# EAGLE design schaltplan (EAGLE 7.2.0)
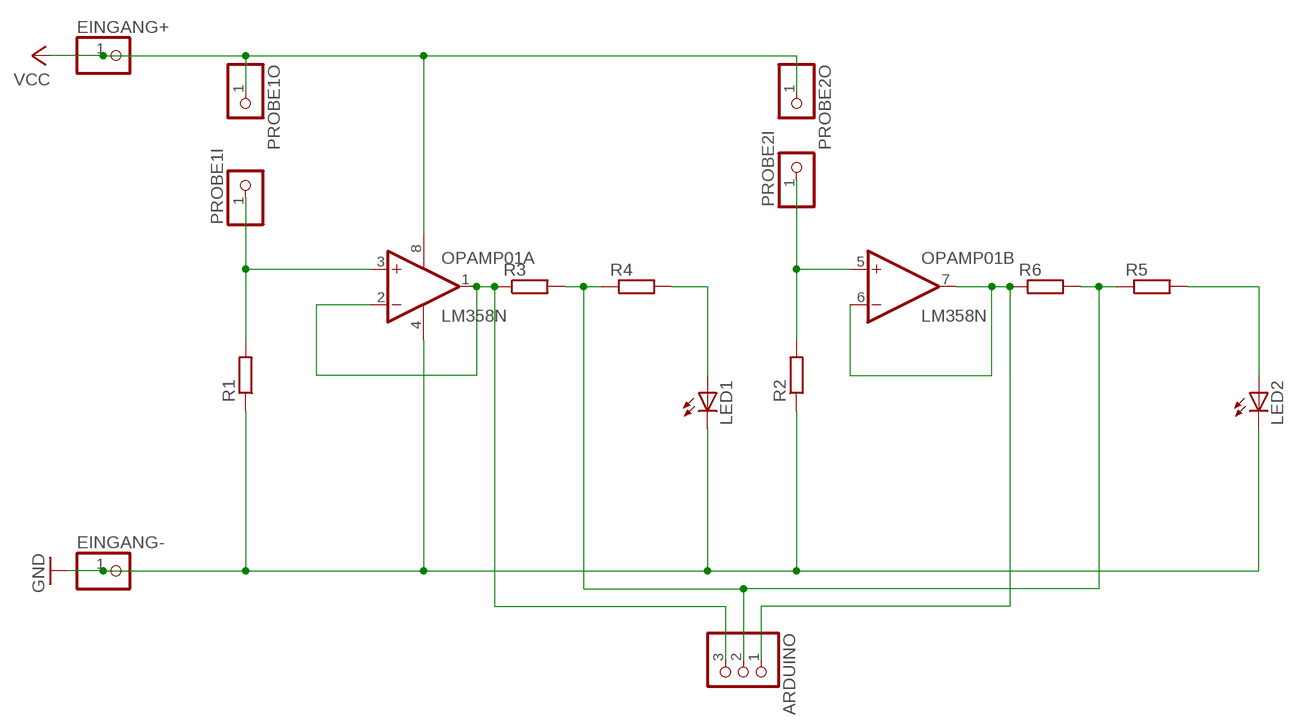
[diagram p0: schematic, sheet 1]

## Parts
ARDUINO  PINHD-1X3  [1X03]
EINGANG+  PINHD-1X1  [1X01]
EINGANG-  PINHD-1X1  [1X01]
LED1  LED5MM  [LED5MM]
LED2  LED5MM  [LED5MM]
OPAMP01  LM358N  [DIL08]
PROBE1I  PINHD-1X1  [1X01]
PROBE1O  PINHD-1X1  [1X01]
PROBE2I  PINHD-1X1  [1X01]
PROBE2O  PINHD-1X1  [1X01]
R1  R-EU_0207/7  [0207/7]
R2  R-EU_0207/7  [0207/7]
R3  R-EU_0207/7  [0207/7]
R4  R-EU_0207/7  [0207/7]
R5  R-EU_0207/7  [0207/7]
R6  R-EU_0207/7  [0207/7]

## Nets
GND: EINGANG-.1 LED1.K(C) LED2.K(C) OPAMP01.4(P:V-) R1.1 R2.1
N$1: OPAMP01.3(A:+IN) PROBE1I.1 R1.2
N$2: OPAMP01.5(B:+IN) PROBE2I.1 R2.2
N$3: ARDUINO.3 OPAMP01.1(A:OUT) OPAMP01.2(A:-IN) R3.1
N$4: LED1.A R4.2
N$6: ARDUINO.1 OPAMP01.6(B:-IN) OPAMP01.7(B:OUT) R6.1
N$7: ARDUINO.2 R3.2 R4.1 R5.1 R6.2
N$8: LED2.A R5.2
VCC: EINGANG+.1 OPAMP01.8(P:V+) PROBE1O.1 PROBE2O.1

## Library data of the parts
ARDUINO = pinhead:PINHD-1X3: PIN HEADER
EINGANG+ EINGANG- PROBE1I PROBE1O PROBE2I PROBE2O = pinhead:PINHD-1X1: PIN HEADER
LED1 LED2 = led:LED: LED OSRAM: - CHIPLED LG R971, LG N971, LY N971, LG Q971, LY Q971, LO R971, LY R971 LH N974, LH R974 LS Q976, LO Q976, LY Q976 LO Q996 - Hyper CHIPLED LW Q18S LB Q993, LB Q99A, LB R99A - SideLED LS A670, LO A670, LY A670, LG A670, LP A670 LB A673, LV A673, LT A673, LW A673 LH A674 LY A675 LS A676, LA A676, LO A676, LY A676, LW A676 LS A679, LY A679, LG A679 - Hyper Micro SIDELED® LS Y876, LA Y876, LO Y876, LY Y876 LT Y87S - SmartLED LW L88C, LW L88S LB L89C, LB L89S, LG L890 LS L89K, LO L89K, LY L89K LS L896, LA L896, LO L896, LY L896 - TOPLED LS T670, LO T670, LY T670, LG T670, LP T670 LSG T670, LSP T670, LSY T670, LOP T670, LYG T670 LG T671, LOG T671, LSG T671 LB T673, LV T673, LT T673, LW T673 LH T674 LS T676, LA T676, LO T676, LY T676, LB T676, LH T676, LSB T676, LW T676 LB T67C, LV T67C, LT T67C, LS T67K, LO T67K, LY T67K, LW E67C LS E67B, LA E67B, LO E67B, LY E67B, LB E67C, LV E67C, LT E67C LW T67C LS T679, LY T679, LG T679 LS T770, LO T770, LY T770, LG T770, LP T770 LB T773, LV T773, LT T773, LW T773 LH T774 LS E675, LA E675, LY E675, LS T675 LS T776, LA T776, LO T776, LY T776, LB T776 LHGB T686 LT T68C, LB T68C - Hyper Mini TOPLED® LB M676 - Mini TOPLED Santana® LG M470 LS M47K, LO M47K, LY M47K Source: http://www.osram.convergy.de LUXEON: - LUMILED® LXK2-PW12-R00, LXK2-PW12-S00, LXK2-PW14-U00, LXK2-PW14-V00 LXK2-PM12-R00, LXK2-PM12-S00, LXK2-PM14-U00 LXK2-PE12-Q00, LXK2-PE12-R00, LXK2-PE12-S00, LXK2-PE14-T00, LXK2-PE14-U00 LXK2-PB12-K00, LXK2-PB12-L00, LXK2-PB12-M00, LXK2-PB14-N00, LXK2-PB14-P00, LXK2-PB14-Q00 LXK2-PR12-L00, LXK2-PR12-M00, LXK2-PR14-Q00, LXK2-PR14-R00 LXK2-PD12-Q00, LXK2-PD12-R00, LXK2-PD12-S00 LXK2-PH12-R00, LXK2-PH12-S00 LXK2-PL12-P00, LXK2-PL12-Q00, LXK2-PL12-R00 Source: www.luxeon.com KINGBRIGHT: KA-3528ASYC Source: www.kingbright.com
OPAMP01 = linear:LM358: OP AMP also LM158; LM258; LM2904 Source: http://cache.national.com/ds/LM/LM158.pdf
R1-R6 = rcl:R-EU_: RESISTOR, European symbol

## Board
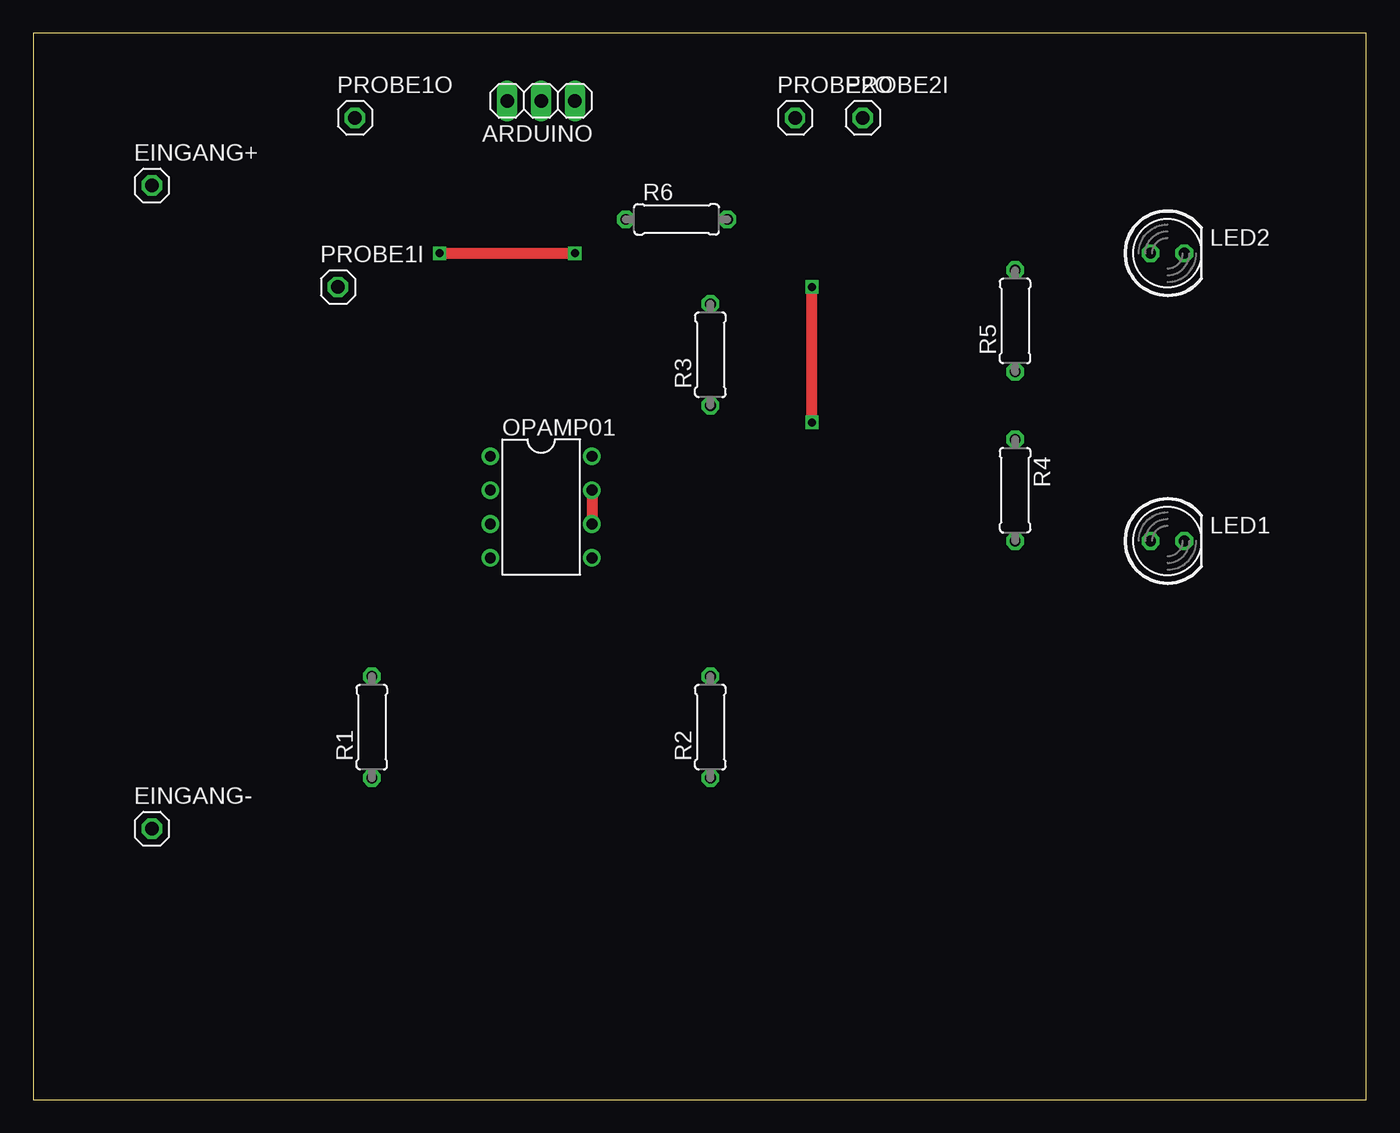
[diagram p1: board, top side]
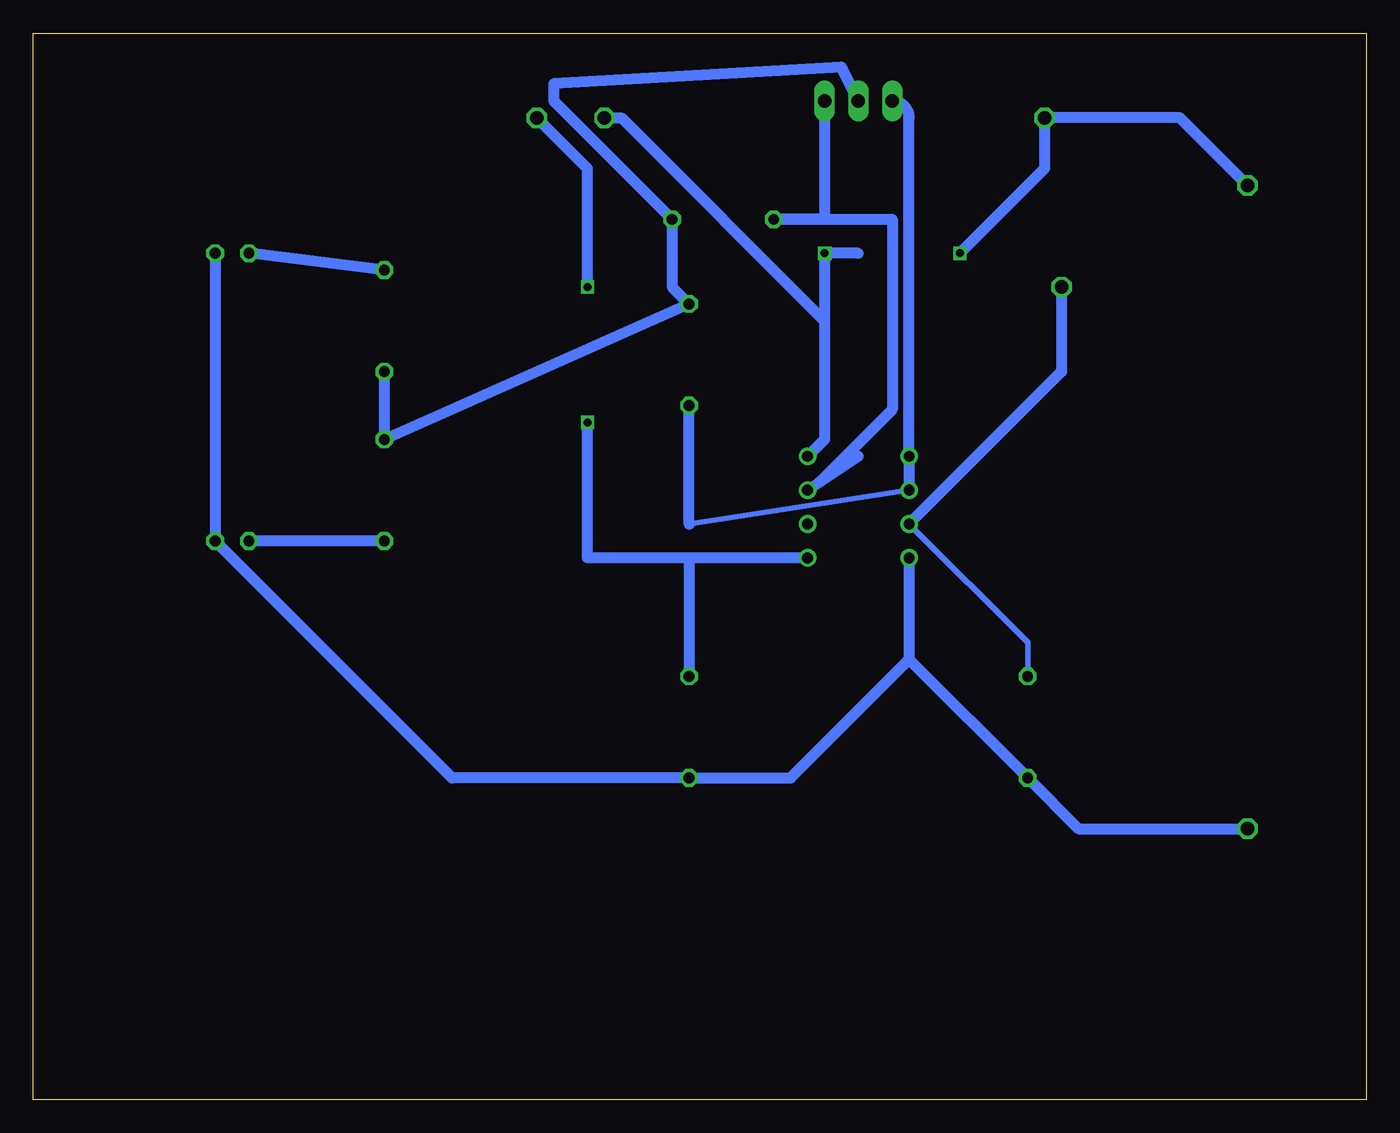
[diagram p2: board, bottom side, seen from below]

Size 100 x 80 mm. Coordinates in mm from the lower left corner, seen from the top.
Outline: 0,0 100,0 100,80 0,80 0,0
Copper layers (1*16): Top 0.035mm / dielectric 1.5mm / Bottom 0.035mm
Design rules "default *": minimum track width 10mil, minimum drill 20mil, track to track 8mil, track to pad 8mil, pad to pad 8mil, via to via 8mil, smd to smd 8mil, copper to edge 40mil, drill to drill 8mil, minimum pad ring 10mil, minimum via ring 8mil, stop-mask expansion 4mil, vias tented up to drill 0mil, thermal gap 10mil

### Footprints (pad centres in the part's own frame; a part is rotated, then mirrored left to right if it is on the bottom)
1X03 = drill 1.016 long: 1 -2.54,0; 2 0,0; 3 2.54,0
1X01 = drill 1.016 octagon: 1 0,0
LED5MM = drill 0.813 octagon: A -1.27,0; K 1.27,0
DIL08 = drill 0.813 pad 1.27: 1 -3.81,-3.81; 2 -1.27,-3.81; 3 1.27,-3.81; 4 3.81,-3.81; 5 3.81,3.81; 6 1.27,3.81; 7 -1.27,3.81; 8 -3.81,3.81
0207/7 = drill 0.813 octagon: 1 -3.81,0; 2 3.81,0

### Placement (x,y rotation side)
ARDUINO  38.1,74.93 180 top
EINGANG+  8.89,68.58 0 top
EINGANG-  8.89,20.32 0 top
LED1  85.09,41.91 0 top
LED2  85.09,63.5 0 top
OPAMP01  38.1,44.45 270 top
PROBE1I  22.86,60.96 0 top
PROBE1O  24.13,73.66 0 top
PROBE2I  62.23,73.66 0 top
PROBE2O  57.15,73.66 0 top
R1  25.4,27.94 90 top
R2  50.8,27.94 90 top
R3  50.8,55.88 90 top
R4  73.66,45.72 270 top
R5  73.66,58.42 90 top
R6  48.26,66.04 0 top

### Tracks (layer width: path | path; a pad name or v marks a point on that pad's centre or on a via)
GND
  Bottom 0.813: EINGANG-.1 21.59,20.32 R1.1 34.29,33.02 | OPAMP01.4 34.29,33.02 | LED2.K LED1.K 68.58,24.13 R2.1 43.18,24.13 34.29,33.02
N$1
  Bottom 0.406: R1.2 25.4,34.29 OPAMP01.3
  Bottom 0.813: PROBE1I.1 22.86,54.61 OPAMP01.3
N$2  (via drill 0.6)
  Top 0.813: v58.42,50.8 v58.42,60.96
  Bottom 0.813: R2.2 50.8,40.64 OPAMP01.5 58.42,40.64 v58.42,50.8 | v58.42,60.96 58.42,69.85 PROBE2I.1
N$3
  Bottom 0.406: OPAMP01.2 50.8,43.18
  Bottom 0.813: ARDUINO.3 arc90 34.29,73.66 OPAMP01.1 OPAMP01.2 | 50.8,43.18 R3.1
N$4
  Bottom 0.813: R4.2 LED1.A
N$6
  Top 0.813: OPAMP01.7 OPAMP01.6
  Bottom 0.813: ARDUINO.1 40.64,66.04 R6.1 35.56,66.04 35.56,51.78 41.03,46.31 | 38.1,48.26 41.03,46.31 | 41.03,46.31 OPAMP01.7
N$7
  Bottom 0.813: R5.1 R4.1 R3.2 52.07,60.96 R6.2 60.96,74.93 60.96,76.2 39.37,77.47 ARDUINO.2
N$8
  Bottom 0.813: R5.2 LED2.A
VCC  (via drill 0.6)
  Top 0.813: v30.48,63.5 v40.64,63.5
  Bottom 0.813: EINGANG+.1 13.97,73.66 PROBE1O.1 24.13,69.85 v30.48,63.5 | 40.64,58.42 40.64,49.53 OPAMP01.8 | PROBE2O.1 55.88,73.66 40.64,58.42 | 38.1,63.5 v40.64,63.5 40.64,58.42